# Altium project PolySomeCrypto01.PrjPcb (part 2 of 2)

## Sheet GPIOs.SchDoc: POLYSOME CRYPTO 01
size A4; Revision: V1; SheetNumber: 6; SheetTotal: 8; ProjectName: POLYSOME CRYPTO 01
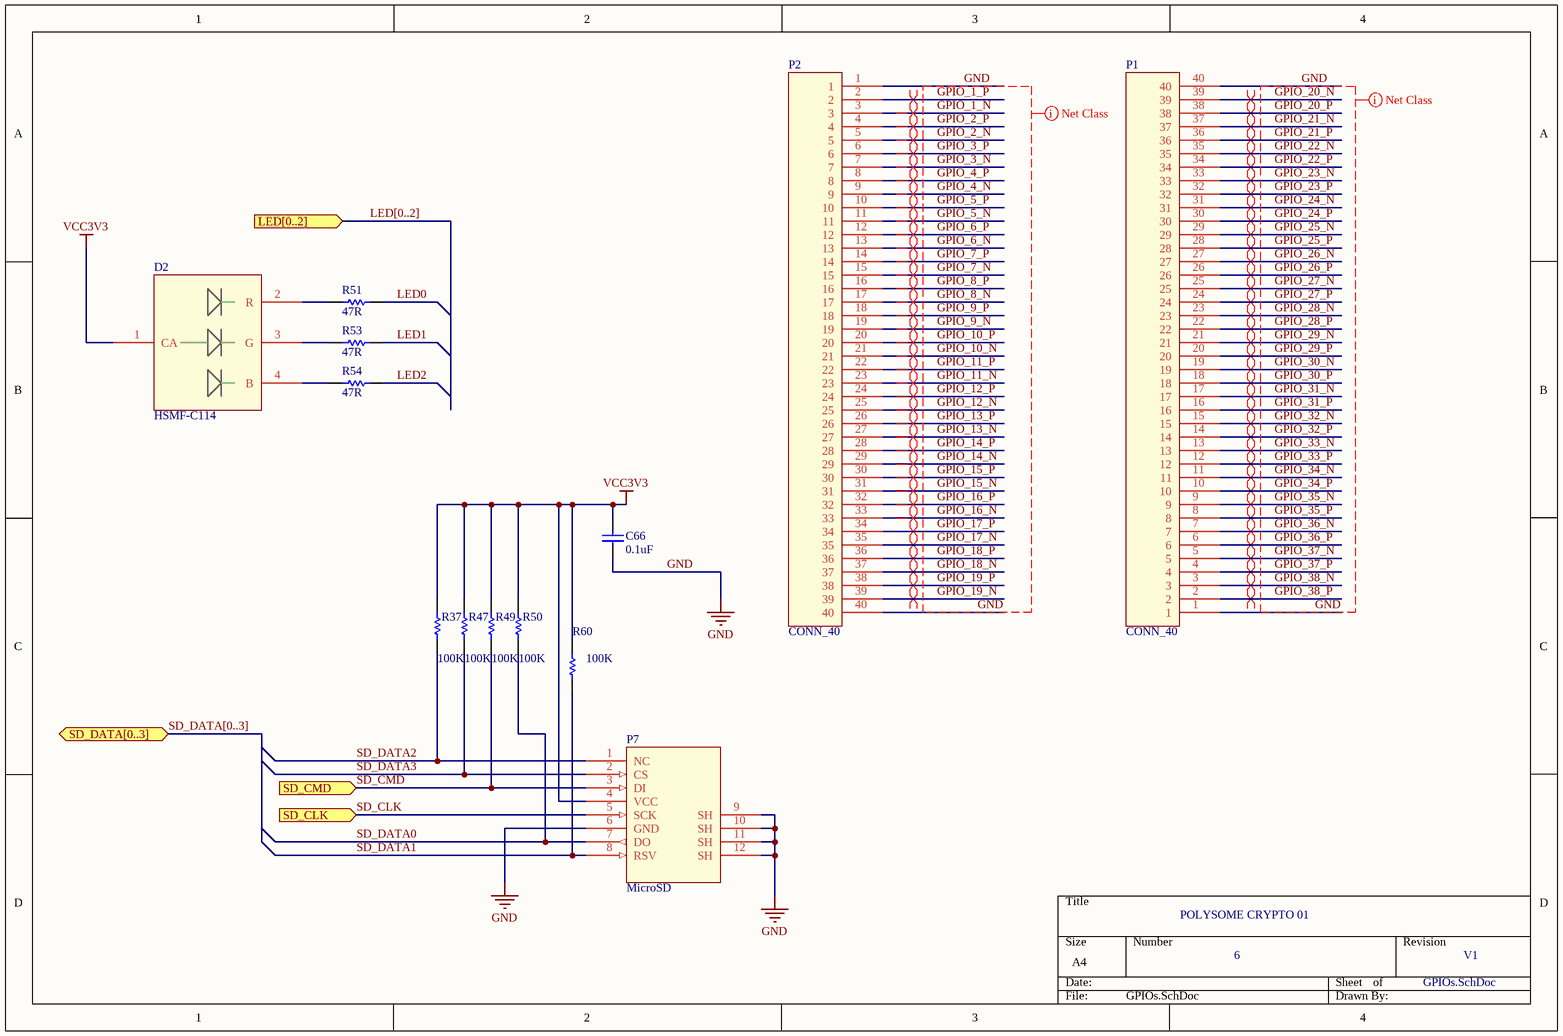
[diagram p7: GPIOs.SchDoc]

### Parts
C66  value 0.1uF  [0402]  (hidden comment: Cap Semi)
D2  HSMF-C114  [DFN110P150X35-4N]
P1  CONN_40  [FH12-40S-0.5SH]
P2  CONN_40  [FH12-40S-0.5SH]
P7  MicroSD  [MicroSD]
R37  value 100K  [0402]  (hidden comment: Res Semi)
R47  value 100K  [0402]  (hidden comment: Res Semi)
R49  value 100K  [0402]  (hidden comment: Res Semi)
R50  value 100K  [0402]  (hidden comment: Res Semi)
R51  value 47R  [0402]  (hidden comment: Res Semi)
R53  value 47R  [0402]  (hidden comment: Res Semi)
R54  value 47R  [0402]  (hidden comment: Res Semi)
R60  value 100K  [0402]  (hidden comment: Res Semi)

### Ports
LED[0..2] (in), SD_CLK (in), SD_CMD (in), SD_DATA[0..3] (bidir)

### Nets
GND: C66.1 P1.1 P1.40 P2.1 P2.40 P7.6(GND) P7.9(SH) P7.10(SH) P7.11(SH) P7.12(SH)
VCC3V3: C66.2 D2.1(CA) P7.4(VCC) R37.2 R47.2 R49.2 R50.2 R60.2
GPIO_1_N: P2.3
GPIO_1_P: P2.2
GPIO_2_N: P2.5
GPIO_2_P: P2.4
GPIO_3_N: P2.7
GPIO_3_P: P2.6
GPIO_4_N: P2.9
GPIO_4_P: P2.8
GPIO_5_N: P2.11
GPIO_5_P: P2.10
GPIO_6_N: P2.13
GPIO_6_P: P2.12
GPIO_7_N: P2.15
GPIO_7_P: P2.14
GPIO_8_N: P2.17
GPIO_8_P: P2.16
GPIO_9_N: P2.19
GPIO_9_P: P2.18
GPIO_10_N: P2.21
GPIO_10_P: P2.20
GPIO_11_N: P2.23
GPIO_11_P: P2.22
GPIO_12_N: P2.25
GPIO_12_P: P2.24
GPIO_13_N: P2.27
GPIO_13_P: P2.26
GPIO_14_N: P2.29
GPIO_14_P: P2.28
GPIO_15_N: P2.31
GPIO_15_P: P2.30
GPIO_16_N: P2.33
GPIO_16_P: P2.32
GPIO_17_N: P2.35
GPIO_17_P: P2.34
GPIO_18_N: P2.37
GPIO_18_P: P2.36
GPIO_19_N: P2.39
GPIO_19_P: P2.38
GPIO_20_N: P1.39
GPIO_20_P: P1.38
GPIO_21_N: P1.37
GPIO_21_P: P1.36
GPIO_22_N: P1.35
GPIO_22_P: P1.34
GPIO_23_N: P1.33
GPIO_23_P: P1.32
GPIO_24_N: P1.31
GPIO_24_P: P1.30
GPIO_25_N: P1.29
GPIO_25_P: P1.28
GPIO_26_N: P1.27
GPIO_26_P: P1.26
GPIO_27_N: P1.25
GPIO_27_P: P1.24
GPIO_28_N: P1.23
GPIO_28_P: P1.22
GPIO_29_N: P1.21
GPIO_29_P: P1.20
GPIO_30_N: P1.19
GPIO_30_P: P1.18
GPIO_31_N: P1.17
GPIO_31_P: P1.16
GPIO_32_N: P1.15
GPIO_32_P: P1.14
GPIO_33_N: P1.13
GPIO_33_P: P1.12
GPIO_34_N: P1.11
GPIO_34_P: P1.10
GPIO_35_N: P1.9
GPIO_35_P: P1.8
GPIO_36_N: P1.7
GPIO_36_P: P1.6
GPIO_37_N: P1.5
GPIO_37_P: P1.4
GPIO_38_N: P1.3
GPIO_38_P: P1.2
LED0: R51.2
LED1: R53.2
LED2: R54.2
SD_CLK: P7.5(SCK) ; port SD_CLK
SD_CMD: P7.3(DI) R49.1 ; port SD_CMD
SD_DATA0: P7.7(DO) R50.1
SD_DATA1: P7.8(RSV) R60.1
SD_DATA2: P7.1(NC) R37.1
SD_DATA3: P7.2(CS) R47.1
NetD2_2: D2.2(R) R51.1
NetD2_3: D2.3(G) R53.1
NetD2_4: D2.4(B) R54.1

### Buses and harness runs
bus LED[0..2] = port LED[0..2]
bus SD_DATA[0..3] = port SD_DATA[0..3]

### Layout directives
differential pair: GPIO_1_N, GPIO_1_P, GPIO_2_N, GPIO_2_P, GPIO_3_N, GPIO_3_P, GPIO_4_N, GPIO_4_P, GPIO_5_N, GPIO_5_P, GPIO_6_N, GPIO_6_P, GPIO_7_N, GPIO_7_P, GPIO_8_N, GPIO_8_P, GPIO_9_N, GPIO_9_P, GPIO_10_N, GPIO_10_P, GPIO_11_N, GPIO_11_P, GPIO_12_N, GPIO_12_P, GPIO_13_N, GPIO_13_P, GPIO_14_N, GPIO_14_P, GPIO_15_N, GPIO_15_P, GPIO_16_N, GPIO_16_P, GPIO_17_N, GPIO_17_P, GPIO_18_N, GPIO_18_P, GPIO_19_N, GPIO_19_P, GPIO_20_N, GPIO_20_P, GPIO_21_N, GPIO_21_P, GPIO_22_N, GPIO_22_P, GPIO_23_N, GPIO_23_P, GPIO_24_N, GPIO_24_P, GPIO_25_N, GPIO_25_P, GPIO_26_N, GPIO_26_P, GPIO_27_N, GPIO_27_P, GPIO_28_N, GPIO_28_P, GPIO_29_N, GPIO_29_P, GPIO_30_N, GPIO_30_P, GPIO_31_N, GPIO_31_P, GPIO_32_N, GPIO_32_P, GPIO_33_N, GPIO_33_P, GPIO_34_N, GPIO_34_P, GPIO_35_N, GPIO_35_P, GPIO_36_N, GPIO_36_P, GPIO_37_N, GPIO_37_P, GPIO_38_N, GPIO_38_P
net class GPIO: GND, GPIO_1_N, GPIO_1_P, GPIO_2_N, GPIO_2_P, GPIO_3_N, GPIO_3_P, GPIO_4_N, GPIO_4_P, GPIO_5_N, GPIO_5_P, GPIO_6_N, GPIO_6_P, GPIO_7_N, GPIO_7_P, GPIO_8_N, GPIO_8_P, GPIO_9_N, GPIO_9_P, GPIO_10_N, GPIO_10_P, GPIO_11_N, GPIO_11_P, GPIO_12_N, GPIO_12_P, GPIO_13_N, GPIO_13_P, GPIO_14_N, GPIO_14_P, GPIO_15_N, GPIO_15_P, GPIO_16_N, GPIO_16_P, GPIO_17_N, GPIO_17_P, GPIO_18_N, GPIO_18_P, GPIO_19_N, GPIO_19_P, GPIO_20_N, GPIO_20_P, GPIO_21_N, GPIO_21_P, GPIO_22_N, GPIO_22_P, GPIO_23_N, GPIO_23_P, GPIO_24_N, GPIO_24_P, GPIO_25_N, GPIO_25_P, GPIO_26_N, GPIO_26_P, GPIO_27_N, GPIO_27_P, GPIO_28_N, GPIO_28_P, GPIO_29_N, GPIO_29_P, GPIO_30_N, GPIO_30_P, GPIO_31_N, GPIO_31_P, GPIO_32_N, GPIO_32_P, GPIO_33_N, GPIO_33_P, GPIO_34_N, GPIO_34_P, GPIO_35_N, GPIO_35_P, GPIO_36_N, GPIO_36_P, GPIO_37_N, GPIO_37_P, GPIO_38_N, GPIO_38_P

### Library data of the parts
C66 = Cap Semi: Capacitor (Semiconductor SIM Model); Published: 8-Jun-2000; LatestRevisionDate: 29-May-2009; LatestRevisionNote: IPC-7351 Footprint Added.; PackageReference: C1206; Publisher: Altium Limited; PackageDescription: Chip Capacitor
D2 = HSMF-C114: LED CHIP RGB 1.6X1.5X0.35MM SMD; Manufacturer: Avago Technologies US Inc.; Color: Red, Green, Blue (RGB); Wavelength - Dominant: 626nm, 525nm, 470nm; Wavelength - Peak: 637nm, 523nm, 468nm; Millicandela Rating: 85mcd Red, 180mcd Green, 70mcd Blue; Voltage - Forward (Vf) (Typ): 1.9V Red, 3.4V Green, 3.4V Blue; Current - Test: 20mA; Viewing Angle: 140°, 145°, 145°; Lens Type: Diffused; Lens Style/Size: Rectangle with Flat Top, 1.5mm x 1.1mm; Supplier 1: Digi-Key; Manufacturer Part Number: HSMF-C114; RoHS: RoHS Compliant; Category: Optoelectronics; Stock 1: 23973; Pricing 1: 1=2.03, 10=1.62, 25=1.2376, 100=1.125, 250=0.99, 500=0.8325, 1000=0.72 (USD); Packaging: Cut Tape (CT); Package / Case: 0606 (1616 Metric); Size / Dimension: 1.60mm L x 1.50mm W; Height: 0.35mm; Mounting Type: Surface Mount; Luminous Flux @ Current - Test: -; ComponentLink1URL: http://www.avagotech.com/docs/AV02-2451EN; ComponentLink1Description: http://www.avagotech.com/docs/AV02-2451EN; Supplier Part Number 1: 516-1795-1-ND
R37 R47 R49-R51 R53 R54 R60 = Res Semi: Semiconductor Resistor; Published: 8-Jun-2000; LatestRevisionDate: 17-Jul-2002; LatestRevisionNote: Re-released for DXP Platform.; PackageReference: AXIAL-0.5; Publisher: Altium Limited; PackageDescription: Axial Device, Thru-Hole; 2 Leads; 0.5 in Pin Spacing

## Nets that join several sheets
GND: DDR3 (72 pins), FPGA_A (R25.2 R26.2), FPGA_B (13 pins), FPGA_C (118 pins), MiniPCIe (22 pins), PowerSupply (28 pins), GPIOs (10 pins)
VCC0V75: DDR3 (50 pins), FPGA_A (7 pins), PowerSupply (C81.1 C82.1 U8.3 U8.5)
VCC1V2: FPGA_C (31 pins), MiniPCIe (20 pins), PowerSupply (6 pins)
VCC01V5: DDR3 (25 pins), FPGA_C (26 pins), PowerSupply (6 pins)
VCC1V5: DDR3 (29 pins), FPGA_C (14 pins), MiniPCIe (P8.6 P8.28 P8.48), PowerSupply (5 pins)
VCC3V3: FPGA_B (12 pins), FPGA_C (45 pins), MiniPCIe (9 pins), PowerSupply (22 pins), GPIOs (8 pins)
CLKREQ#: FPGA_B (U3.AB14), MiniPCIe (P8.7)
DDR0-A0: DDR3 (R18.1 U1.N3), FPGA_A (U3.K2)
DDR0-A1: DDR3 (R15.2 U1.P7), FPGA_A (U3.K1)
DDR0-A2: DDR3 (R18.3 U1.P3), FPGA_A (U3.K5)
DDR0-A3: DDR3 (R14.4 U1.N2), FPGA_A (U3.M6)
DDR0-A4: DDR3 (R15.1 U1.P8), FPGA_A (U3.H3)
DDR0-A5: DDR3 (R14.3 U1.P2), FPGA_A (U3.M3)
DDR0-A6: DDR3 (R15.4 U1.R8), FPGA_A (U3.L4)
DDR0-A7: DDR3 (R14.2 U1.R2), FPGA_A (U3.K6)
DDR0-A8: DDR3 (R15.3 U1.T8), FPGA_A (U3.G3)
DDR0-A9: DDR3 (R18.4 U1.R3), FPGA_A (U3.G1)
DDR0-A10: DDR3 (R17.3 U1.L7), FPGA_A (U3.J4)
DDR0-A11: DDR3 (R17.1 U1.R7), FPGA_A (U3.E1)
DDR0-A12: DDR3 (R17.2 U1.N7), FPGA_A (U3.F1)
DDR0-A13: DDR3 (R13.1 U1.T3), FPGA_A (U3.J6)
DDR0-A14: DDR3 (R16.2 U1.T7), FPGA_A (U3.H5)
DDR0-BA0: DDR3 (R16.1 U1.M2), FPGA_A (U3.J3)
DDR0-BA1: DDR3 (R17.4 U1.N8), FPGA_A (U3.J1)
DDR0-BA2: DDR3 (R18.2 U1.M3), FPGA_A (U3.H1)
DDR0-CAS: DDR3 (R16.3 U1.K3), FPGA_A (U3.M4)
DDR0-CK_N: DDR3 (R2.2 U1.K7), FPGA_A (U3.K3)
DDR0-CK_P: DDR3 (R2.1 U1.J7), FPGA_A (U3.K4)
DDR0-CKE: DDR3 (R8.2 U1.K9), FPGA_A (U3.F2)
DDR0-DQ0: DDR3 (U1.E3), FPGA_A (U3.R3)
DDR0-DQ1: DDR3 (U1.F7), FPGA_A (U3.R1)
DDR0-DQ2: DDR3 (U1.F2), FPGA_A (U3.P2)
DDR0-DQ3: DDR3 (U1.F8), FPGA_A (U3.P1)
DDR0-DQ4: DDR3 (U1.H3), FPGA_A (U3.L3)
DDR0-DQ5: DDR3 (U1.H8), FPGA_A (U3.L1)
DDR0-DQ6: DDR3 (U1.G2), FPGA_A (U3.M2)
DDR0-DQ7: DDR3 (U1.H7), FPGA_A (U3.M1)
DDR0-DQ8: DDR3 (U1.D7), FPGA_A (U3.T2)
DDR0-DQ9: DDR3 (U1.C3), FPGA_A (U3.T1)
DDR0-DQ10: DDR3 (U1.C8), FPGA_A (U3.U3)
DDR0-DQ11: DDR3 (U1.C2), FPGA_A (U3.U1)
DDR0-DQ12: DDR3 (U1.A7), FPGA_A (U3.W3)
DDR0-DQ13: DDR3 (U1.A2), FPGA_A (U3.W1)
DDR0-DQ14: DDR3 (U1.B8), FPGA_A (U3.Y2)
DDR0-DQ15: DDR3 (U1.A3), FPGA_A (U3.Y1)
DDR0-LDM: DDR3 (U1.E7), FPGA_A (U3.N4)
DDR0-LDQS_N: DDR3 (U1.G3), FPGA_A (U3.N1)
DDR0-LDQS_P: DDR3 (U1.F3), FPGA_A (U3.N3)
DDR0-ODT: DDR3 (R7.2 U1.K1), FPGA_A (U3.L6)
DDR0-RAS: DDR3 (R16.4 U1.J3), FPGA_A (U3.M5)
DDR0-RESET: DDR3 (R6.2 U1.T2), FPGA_A (U3.E3)
DDR0-UDM: DDR3 (U1.D3), FPGA_A (U3.P3)
DDR0-UDQS_N: DDR3 (U1.B7), FPGA_A (U3.V1)
DDR0-UDQS_P: DDR3 (U1.C7), FPGA_A (U3.V2)
DDR0-WE: DDR3 (R14.1 U1.L3), FPGA_A (U3.H2)
DDR1-A0: DDR3 (R21.3 U2.N3), FPGA_A (U3.H21)
DDR1-A1: DDR3 (R23.2 U2.P7), FPGA_A (U3.H22)
DDR1-A2: DDR3 (R21.4 U2.P3), FPGA_A (U3.G22)
DDR1-A3: DDR3 (R20.4 U2.N2), FPGA_A (U3.J20)
DDR1-A4: DDR3 (R22.3 U2.P8), FPGA_A (U3.H20)
DDR1-A5: DDR3 (R20.3 U2.P2), FPGA_A (U3.M20)
DDR1-A6: DDR3 (R22.1 U2.R8), FPGA_A (U3.M19)
DDR1-A7: DDR3 (R20.2 U2.R2), FPGA_A (U3.G20)
DDR1-A8: DDR3 (R22.2 U2.T8), FPGA_A (U3.E20)
DDR1-A9: DDR3 (R20.1 U2.R3), FPGA_A (U3.E22)
DDR1-A10: DDR3 (R21.1 U2.L7), FPGA_A (U3.J19)
DDR1-A11: DDR3 (R22.4 U2.R7), FPGA_A (U3.H19)
DDR1-A12: DDR3 (R23.3 U2.N7), FPGA_A (U3.F22)
DDR1-A13: DDR3 (R24.3 U2.T3), FPGA_A (U3.G19)
DDR1-A14: DDR3 (R23.1 U2.T7), FPGA_A (U3.F20)
DDR1-BA0: DDR3 (R21.2 U2.M2), FPGA_A (U3.K17)
DDR1-BA1: DDR3 (R23.4 U2.N8), FPGA_A (U3.L17)
DDR1-BA2: DDR3 (R24.4 U2.M3), FPGA_A (U3.K18)
DDR1-CAS: DDR3 (R24.1 U2.K3), FPGA_A (U3.K22)
DDR1-CK_N: DDR3 (R1.2 U2.K7), FPGA_A (U3.L19)
DDR1-CK_P: DDR3 (R1.1 U2.J7), FPGA_A (U3.K20)
DDR1-CKE: DDR3 (R5.2 U2.K9), FPGA_A (U3.F21)
DDR1-DQ0: DDR3 (U2.E3), FPGA_A (U3.R20)
DDR1-DQ1: DDR3 (U2.F7), FPGA_A (U3.R22)
DDR1-DQ2: DDR3 (U2.F2), FPGA_A (U3.P21)
DDR1-DQ3: DDR3 (U2.F8), FPGA_A (U3.P22)
DDR1-DQ4: DDR3 (U2.H3), FPGA_A (U3.L20)
DDR1-DQ5: DDR3 (U2.H8), FPGA_A (U3.L22)
DDR1-DQ6: DDR3 (U2.G2), FPGA_A (U3.M21)
DDR1-DQ7: DDR3 (U2.H7), FPGA_A (U3.M22)
DDR1-DQ8: DDR3 (U2.D7), FPGA_A (U3.T21)
DDR1-DQ9: DDR3 (U2.C3), FPGA_A (U3.T22)
DDR1-DQ10: DDR3 (U2.C8), FPGA_A (U3.U20)
DDR1-DQ11: DDR3 (U2.C2), FPGA_A (U3.U22)
DDR1-DQ12: DDR3 (U2.A7), FPGA_A (U3.W20)
DDR1-DQ13: DDR3 (U2.A2), FPGA_A (U3.W22)
DDR1-DQ14: DDR3 (U2.B8), FPGA_A (U3.Y21)
DDR1-DQ15: DDR3 (U2.A3), FPGA_A (U3.Y22)
DDR1-LDM: DDR3 (U2.E7), FPGA_A (U3.N19)
DDR1-LDQS_N: DDR3 (U2.G3), FPGA_A (U3.N22)
DDR1-LDQS_P: DDR3 (U2.F3), FPGA_A (U3.N20)
DDR1-ODT: DDR3 (R4.2 U2.K1), FPGA_A (U3.J22)
DDR1-RAS: DDR3 (R19.1 U2.J3), FPGA_A (U3.K21)
DDR1-RESET: DDR3 (R3.2 U2.T2), FPGA_A (U3.H18)
DDR1-UDM: DDR3 (U2.D3), FPGA_A (U3.P20)
DDR1-UDQS_N: DDR3 (U2.B7), FPGA_A (U3.V22)
DDR1-UDQS_P: DDR3 (U2.C7), FPGA_A (U3.V21)
DDR1-WE: DDR3 (R24.2 U2.L3), FPGA_A (U3.K19)
GPIO_1_N: FPGA_A (U3.D1), GPIOs (P2.3)
GPIO_1_P: FPGA_A (U3.D2), GPIOs (P2.2)
GPIO_2_N: FPGA_B (U3.A2), GPIOs (P2.5)
GPIO_2_P: FPGA_B (U3.B2), GPIOs (P2.4)
GPIO_3_N: FPGA_B (U3.D5), GPIOs (P2.7)
GPIO_3_P: FPGA_B (U3.D4), GPIOs (P2.6)
GPIO_4_N: FPGA_B (U3.E6), GPIOs (P2.9)
GPIO_4_P: FPGA_B (U3.E5), GPIOs (P2.8)
GPIO_5_N: FPGA_B (U3.A3), GPIOs (P2.11)
GPIO_5_P: FPGA_B (U3.B3), GPIOs (P2.10)
GPIO_6_N: FPGA_B (U3.A4), GPIOs (P2.13)
GPIO_6_P: FPGA_B (U3.C4), GPIOs (P2.12)
GPIO_7_N: FPGA_B (U3.A5), GPIOs (P2.15)
GPIO_7_P: FPGA_B (U3.C5), GPIOs (P2.14)
GPIO_8_N: FPGA_B (U3.F8), GPIOs (P2.17)
GPIO_8_P: FPGA_B (U3.F7), GPIOs (P2.16)
GPIO_9_N: FPGA_B (U3.F15), GPIOs (P2.19)
GPIO_9_P: FPGA_B (U3.F14), GPIOs (P2.18)
GPIO_10_N: FPGA_B (U3.F16), GPIOs (P2.21)
GPIO_10_P: FPGA_B (U3.E16), GPIOs (P2.20)
GPIO_11_N: FPGA_B (U3.A17), GPIOs (P2.23)
GPIO_11_P: FPGA_B (U3.C17), GPIOs (P2.22)
GPIO_12_N: FPGA_B (U3.D19), GPIOs (P2.25)
GPIO_12_P: FPGA_B (U3.D18), GPIOs (P2.24)
GPIO_13_N: FPGA_B (U3.A18), GPIOs (P2.27)
GPIO_13_P: FPGA_B (U3.B18), GPIOs (P2.26)
GPIO_14_N: FPGA_B (U3.A19), GPIOs (P2.29)
GPIO_14_P: FPGA_B (U3.C19), GPIOs (P2.28)
GPIO_15_N: FPGA_B (U3.A20), GPIOs (P2.31)
GPIO_15_P: FPGA_B (U3.B20), GPIOs (P2.30)
GPIO_16_N: FPGA_B (U3.C18), GPIOs (P2.33)
GPIO_16_P: FPGA_B (U3.D17), GPIOs (P2.32)
GPIO_17_N: FPGA_B (U3.F17), GPIOs (P2.35)
GPIO_17_P: FPGA_B (U3.G16), GPIOs (P2.34)
GPIO_18_N: FPGA_A (U3.C22), GPIOs (P2.37)
GPIO_18_P: FPGA_A (U3.C20), GPIOs (P2.36)
GPIO_19_N: FPGA_A (U3.B22), GPIOs (P2.39)
GPIO_19_P: FPGA_A (U3.B21), GPIOs (P2.38)
GPIO_20_N: FPGA_A (U3.AA1), GPIOs (P1.39)
GPIO_20_P: FPGA_A (U3.AA2), GPIOs (P1.38)
GPIO_21_N: FPGA_A (U3.Y3), GPIOs (P1.37)
GPIO_21_P: FPGA_A (U3.W4), GPIOs (P1.36)
GPIO_22_N: FPGA_A (U3.V3), GPIOs (P1.35)
GPIO_22_P: FPGA_A (U3.V5), GPIOs (P1.34)
GPIO_23_N: FPGA_A (U3.R4), GPIOs (P1.33)
GPIO_23_P: FPGA_A (U3.T3), GPIOs (P1.32)
GPIO_24_N: FPGA_A (U3.T4), GPIOs (P1.31)
GPIO_24_P: FPGA_A (U3.U4), GPIOs (P1.30)
GPIO_25_N: FPGA_A (U3.P4), GPIOs (P1.29)
GPIO_25_P: FPGA_A (U3.P5), GPIOs (P1.28)
GPIO_26_N: FPGA_A (U3.T5), GPIOs (P1.27)
GPIO_26_P: FPGA_A (U3.T6), GPIOs (P1.26)
GPIO_27_N: FPGA_A (U3.P7), GPIOs (P1.25)
GPIO_27_P: FPGA_A (U3.P6), GPIOs (P1.24)
GPIO_28_N: FPGA_A (U3.N7), GPIOs (P1.23)
GPIO_28_P: FPGA_A (U3.N6), GPIOs (P1.22)
GPIO_29_N: FPGA_B (U3.F9), GPIOs (P1.21)
GPIO_29_P: FPGA_B (U3.G8), GPIOs (P1.20)
GPIO_30_N: FPGA_B (U3.H11), GPIOs (P1.19)
GPIO_30_P: FPGA_B (U3.H10), GPIOs (P1.18)
GPIO_31_N: FPGA_B (U3.G11), GPIOs (P1.17)
GPIO_31_P: FPGA_B (U3.H12), GPIOs (P1.16)
GPIO_32_N: FPGA_B (U3.G13), GPIOs (P1.15)
GPIO_32_P: FPGA_B (U3.H13), GPIOs (P1.14)
GPIO_33_N: FPGA_B (U3.G15), GPIOs (P1.13)
GPIO_33_P: FPGA_B (U3.H14), GPIOs (P1.12)
GPIO_34_N: FPGA_A (U3.K16), GPIOs (P1.11)
GPIO_34_P: FPGA_A (U3.L15), GPIOs (P1.10)
GPIO_35_N: FPGA_A (U3.J17), GPIOs (P1.9)
GPIO_35_P: FPGA_A (U3.J16), GPIOs (P1.8)
GPIO_36_N: FPGA_A (U3.T17), GPIOs (P1.7)
GPIO_36_P: FPGA_A (U3.R17), GPIOs (P1.6)
GPIO_37_N: FPGA_A (U3.H17), GPIOs (P1.5)
GPIO_37_P: FPGA_A (U3.H16), GPIOs (P1.4)
GPIO_38_N: FPGA_A (U3.V20), GPIOs (P1.3)
GPIO_38_P: FPGA_A (U3.V19), GPIOs (P1.2)
HSWAP: FPGA_B (U3.C3), FPGA_C (R44.2)
INIT_B: FPGA_B (U3.Y4), FPGA_C (R40.2)
LED0: FPGA_B (U3.AB11), GPIOs (R51.2)
LED1: FPGA_B (U3.AB16), GPIOs (R53.2)
LED2: FPGA_B (U3.AA10), GPIOs (R54.2)
PERST: FPGA_B (U3.AB15), MiniPCIe (P8.22 R65.1)
SD_CLK: FPGA_B (U3.Y5), GPIOs (P7.5)
SD_CMD: FPGA_B (U3.AB5), GPIOs (P7.3 R49.1)
SD_DATA0: FPGA_B (U3.U6), GPIOs (P7.7 R50.1)
SD_DATA1: FPGA_B (U3.T7), GPIOs (P7.8 R60.1)
SD_DATA2: FPGA_B (U3.AB4), GPIOs (P7.1 R37.1)
SD_DATA3: FPGA_B (U3.AA4), GPIOs (P7.2 R47.1)
SMB_CLK: FPGA_B (U3.AB17), MiniPCIe (P8.30 R64.1)
SMB_DATA: FPGA_B (U3.AB18), MiniPCIe (P8.32 R63.1)
SPI_D1_MISO2: FPGA_B (R32.1 U3.R13), FPGA_C (P4.14)